# Altium schematic sheet 06-NOTStatusLed.SchDoc
size A4
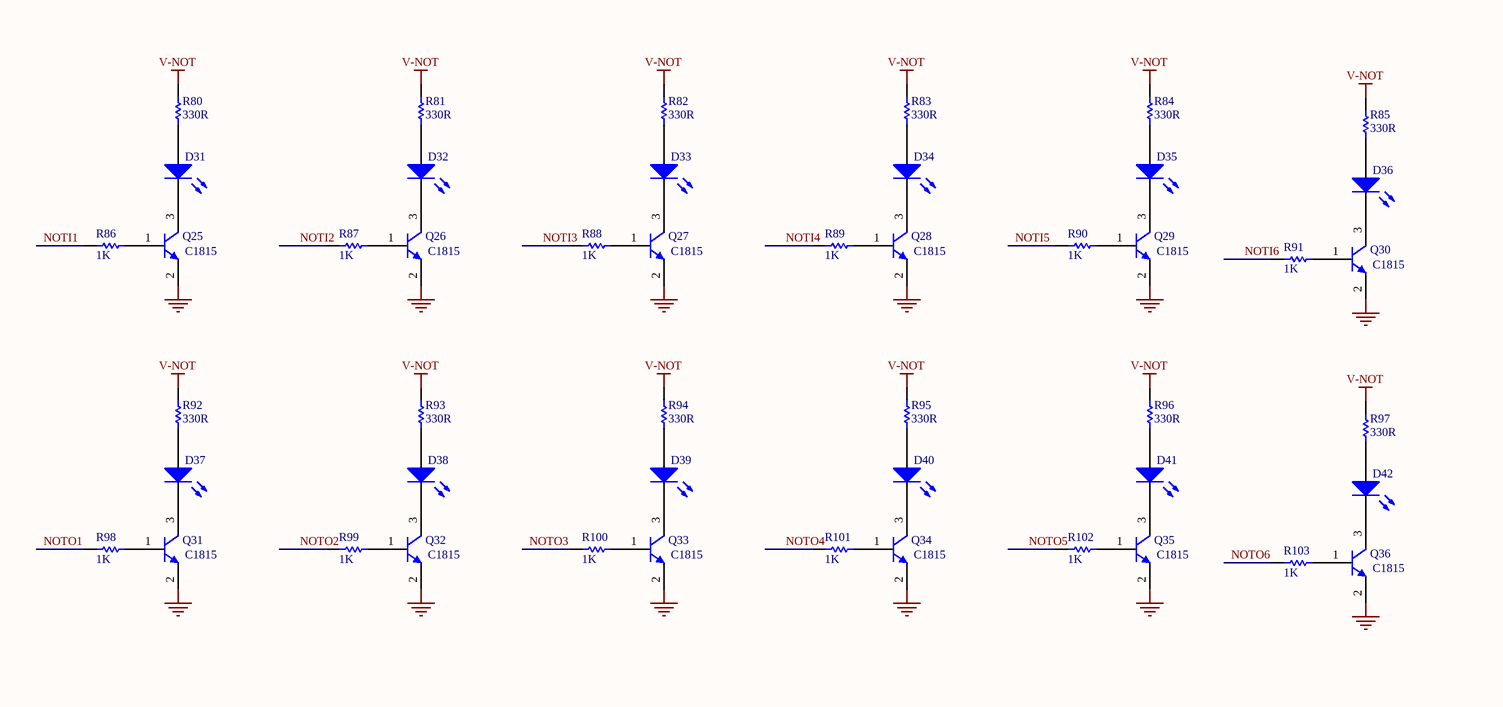
[diagram p0: 06-NOTStatusLed.SchDoc, left]
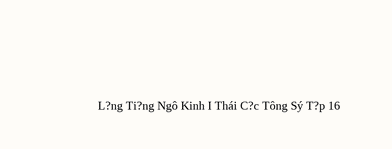
[diagram p1: 06-NOTStatusLed.SchDoc, right]

## Parts
D31  LED  [LED-3528]  (value not drawn)
D32  LED  [LED-3528]  (value not drawn)
D33  LED  [LED-3528]  (value not drawn)
D34  LED  [LED-3528]  (value not drawn)
D35  LED  [LED-3528]  (value not drawn)
D36  LED  [LED-3528]  (value not drawn)
D37  LED  [LED-3528]  (value not drawn)
D38  LED  [LED-3528]  (value not drawn)
D39  LED  [LED-3528]  (value not drawn)
D40  LED  [LED-3528]  (value not drawn)
D41  LED  [LED-3528]  (value not drawn)
D42  LED  [LED-3528]  (value not drawn)
Q25  value C1815  [SOT23-321]  (hidden comment: C1815-SMD)
Q26  value C1815  [SOT23-321]  (hidden comment: C1815-SMD)
Q27  value C1815  [SOT23-321]  (hidden comment: C1815-SMD)
Q28  value C1815  [SOT23-321]  (hidden comment: C1815-SMD)
Q29  value C1815  [SOT23-321]  (hidden comment: C1815-SMD)
Q30  value C1815  [SOT23-321]  (hidden comment: C1815-SMD)
Q31  value C1815  [SOT23-321]  (hidden comment: C1815-SMD)
Q32  value C1815  [SOT23-321]  (hidden comment: C1815-SMD)
Q33  value C1815  [SOT23-321]  (hidden comment: C1815-SMD)
Q34  value C1815  [SOT23-321]  (hidden comment: C1815-SMD)
Q35  value C1815  [SOT23-321]  (hidden comment: C1815-SMD)
Q36  value C1815  [SOT23-321]  (hidden comment: C1815-SMD)
R80  330R  [R-0805]
R81  330R  [R-0805]
R82  330R  [R-0805]
R83  330R  [R-0805]
R84  330R  [R-0805]
R85  330R  [R-0805]
R86  1K  [R-0805]
R87  1K  [R-0805]
R88  1K  [R-0805]
R89  1K  [R-0805]
R90  1K  [R-0805]
R91  1K  [R-0805]
R92  330R  [R-0805]
R93  330R  [R-0805]
R94  330R  [R-0805]
R95  330R  [R-0805]
R96  330R  [R-0805]
R97  330R  [R-0805]
R98  1K  [R-0805]
R99  1K  [R-0805]
R100  1K  [R-0805]
R101  1K  [R-0805]
R102  1K  [R-0805]
R103  1K  [R-0805]

## Nets
GND: Q25.2(E) Q26.2(E) Q27.2(E) Q28.2(E) Q29.2(E) Q30.2(E) Q31.2(E) Q32.2(E) Q33.2(E) Q34.2(E) Q35.2(E) Q36.2(E)
V-NOT: R80.2 R81.2 R82.2 R83.2 R84.2 R85.2 R92.2 R93.2 R94.2 R95.2 R96.2 R97.2
NOTI1: R86.2
NOTI2: R87.2
NOTI3: R88.2
NOTI4: R89.2
NOTI5: R90.2
NOTI6: R91.2
NOTO1: R98.2
NOTO2: R99.2
NOTO3: R100.2
NOTO4: R101.2
NOTO5: R102.2
NOTO6: R103.2
NetD31_1: D31.1(A) R80.1
NetD31_2: D31.2(K) Q25.3(C)
NetD32_1: D32.1(A) R81.1
NetD32_2: D32.2(K) Q26.3(C)
NetD33_1: D33.1(A) R82.1
NetD33_2: D33.2(K) Q27.3(C)
NetD34_1: D34.1(A) R83.1
NetD34_2: D34.2(K) Q28.3(C)
NetD35_1: D35.1(A) R84.1
NetD35_2: D35.2(K) Q29.3(C)
NetD36_1: D36.1(A) R85.1
NetD36_2: D36.2(K) Q30.3(C)
NetD37_1: D37.1(A) R92.1
NetD37_2: D37.2(K) Q31.3(C)
NetD38_1: D38.1(A) R93.1
NetD38_2: D38.2(K) Q32.3(C)
NetD39_1: D39.1(A) R94.1
NetD39_2: D39.2(K) Q33.3(C)
NetD40_1: D40.1(A) R95.1
NetD40_2: D40.2(K) Q34.3(C)
NetD41_1: D41.1(A) R96.1
NetD41_2: D41.2(K) Q35.3(C)
NetD42_1: D42.1(A) R97.1
NetD42_2: D42.2(K) Q36.3(C)
NetQ25_1: Q25.1(B) R86.1
NetQ26_1: Q26.1(B) R87.1
NetQ27_1: Q27.1(B) R88.1
NetQ28_1: Q28.1(B) R89.1
NetQ29_1: Q29.1(B) R90.1
NetQ30_1: Q30.1(B) R91.1
NetQ31_1: Q31.1(B) R98.1
NetQ32_1: Q32.1(B) R99.1
NetQ33_1: Q33.1(B) R100.1
NetQ34_1: Q34.1(B) R101.1
NetQ35_1: Q35.1(B) R102.1
NetQ36_1: Q36.1(B) R103.1

## Notes on the sheet
- L?ng Ti?ng Ngô Kinh I Thái C?c Tông Sý T?p 16

## Library data of the parts
D31-D42 = LED2: Typical RED, GREEN, YELLOW, AMBER GaAs LED; Published: 8-Jun-2000; LatestRevisionDate: 17-Jul-2002; LatestRevisionNote: Re-released for DXP Platform.; PackageVersion: Feb-2002; PackageReference: 3.2X1.6X1.1; Publisher: Altium Limited; PackageDescription: SM LED; 2 Flat Leads
Q25-Q36 = NPN: NPN Bipolar Transistor; Published: 8-Jun-2000; LatestRevisionDate: 17-Jul-2002; LatestRevisionNote: Re-released for DXP Platform.; PackageReference: TO-226-AA; PackageDescription: TO, Flat Index; 3 In-Line, Axial Leads; Body Dia. 4.8mm; Leads 0.55 x 0.51 mm (max); Code_JEDEC: TO-226-AA
R80-R103 = Res1: Resistor; Published: 8-Jun-2000; LatestRevisionDate: 17-Jul-2002; LatestRevisionNote: Re-released for DXP Platform.; PackageReference: AXIAL-0.3; Publisher: Altium Limited; PackageDescription: Axial Device, Thru-Hole; 2 Leads; 0.3 in Pin Spacing
  R80-R85 R92-R97: Value: 330R
  R86-R91 R98-R103: Value: 1K